# EasyEDA Pro project CheeseCake_1stAnn_SP.epro

# Schematic Choco_ANN
Create Date: 2024-06-27; Page Name: BNO085; Project Name: SlimeVR_CheeseCake_BNO085; Schematic Name: Choco_ANN; Update Date: 2024-06-27; Company: Designed by SoraKage; Page Size: A4; Version: V2.3
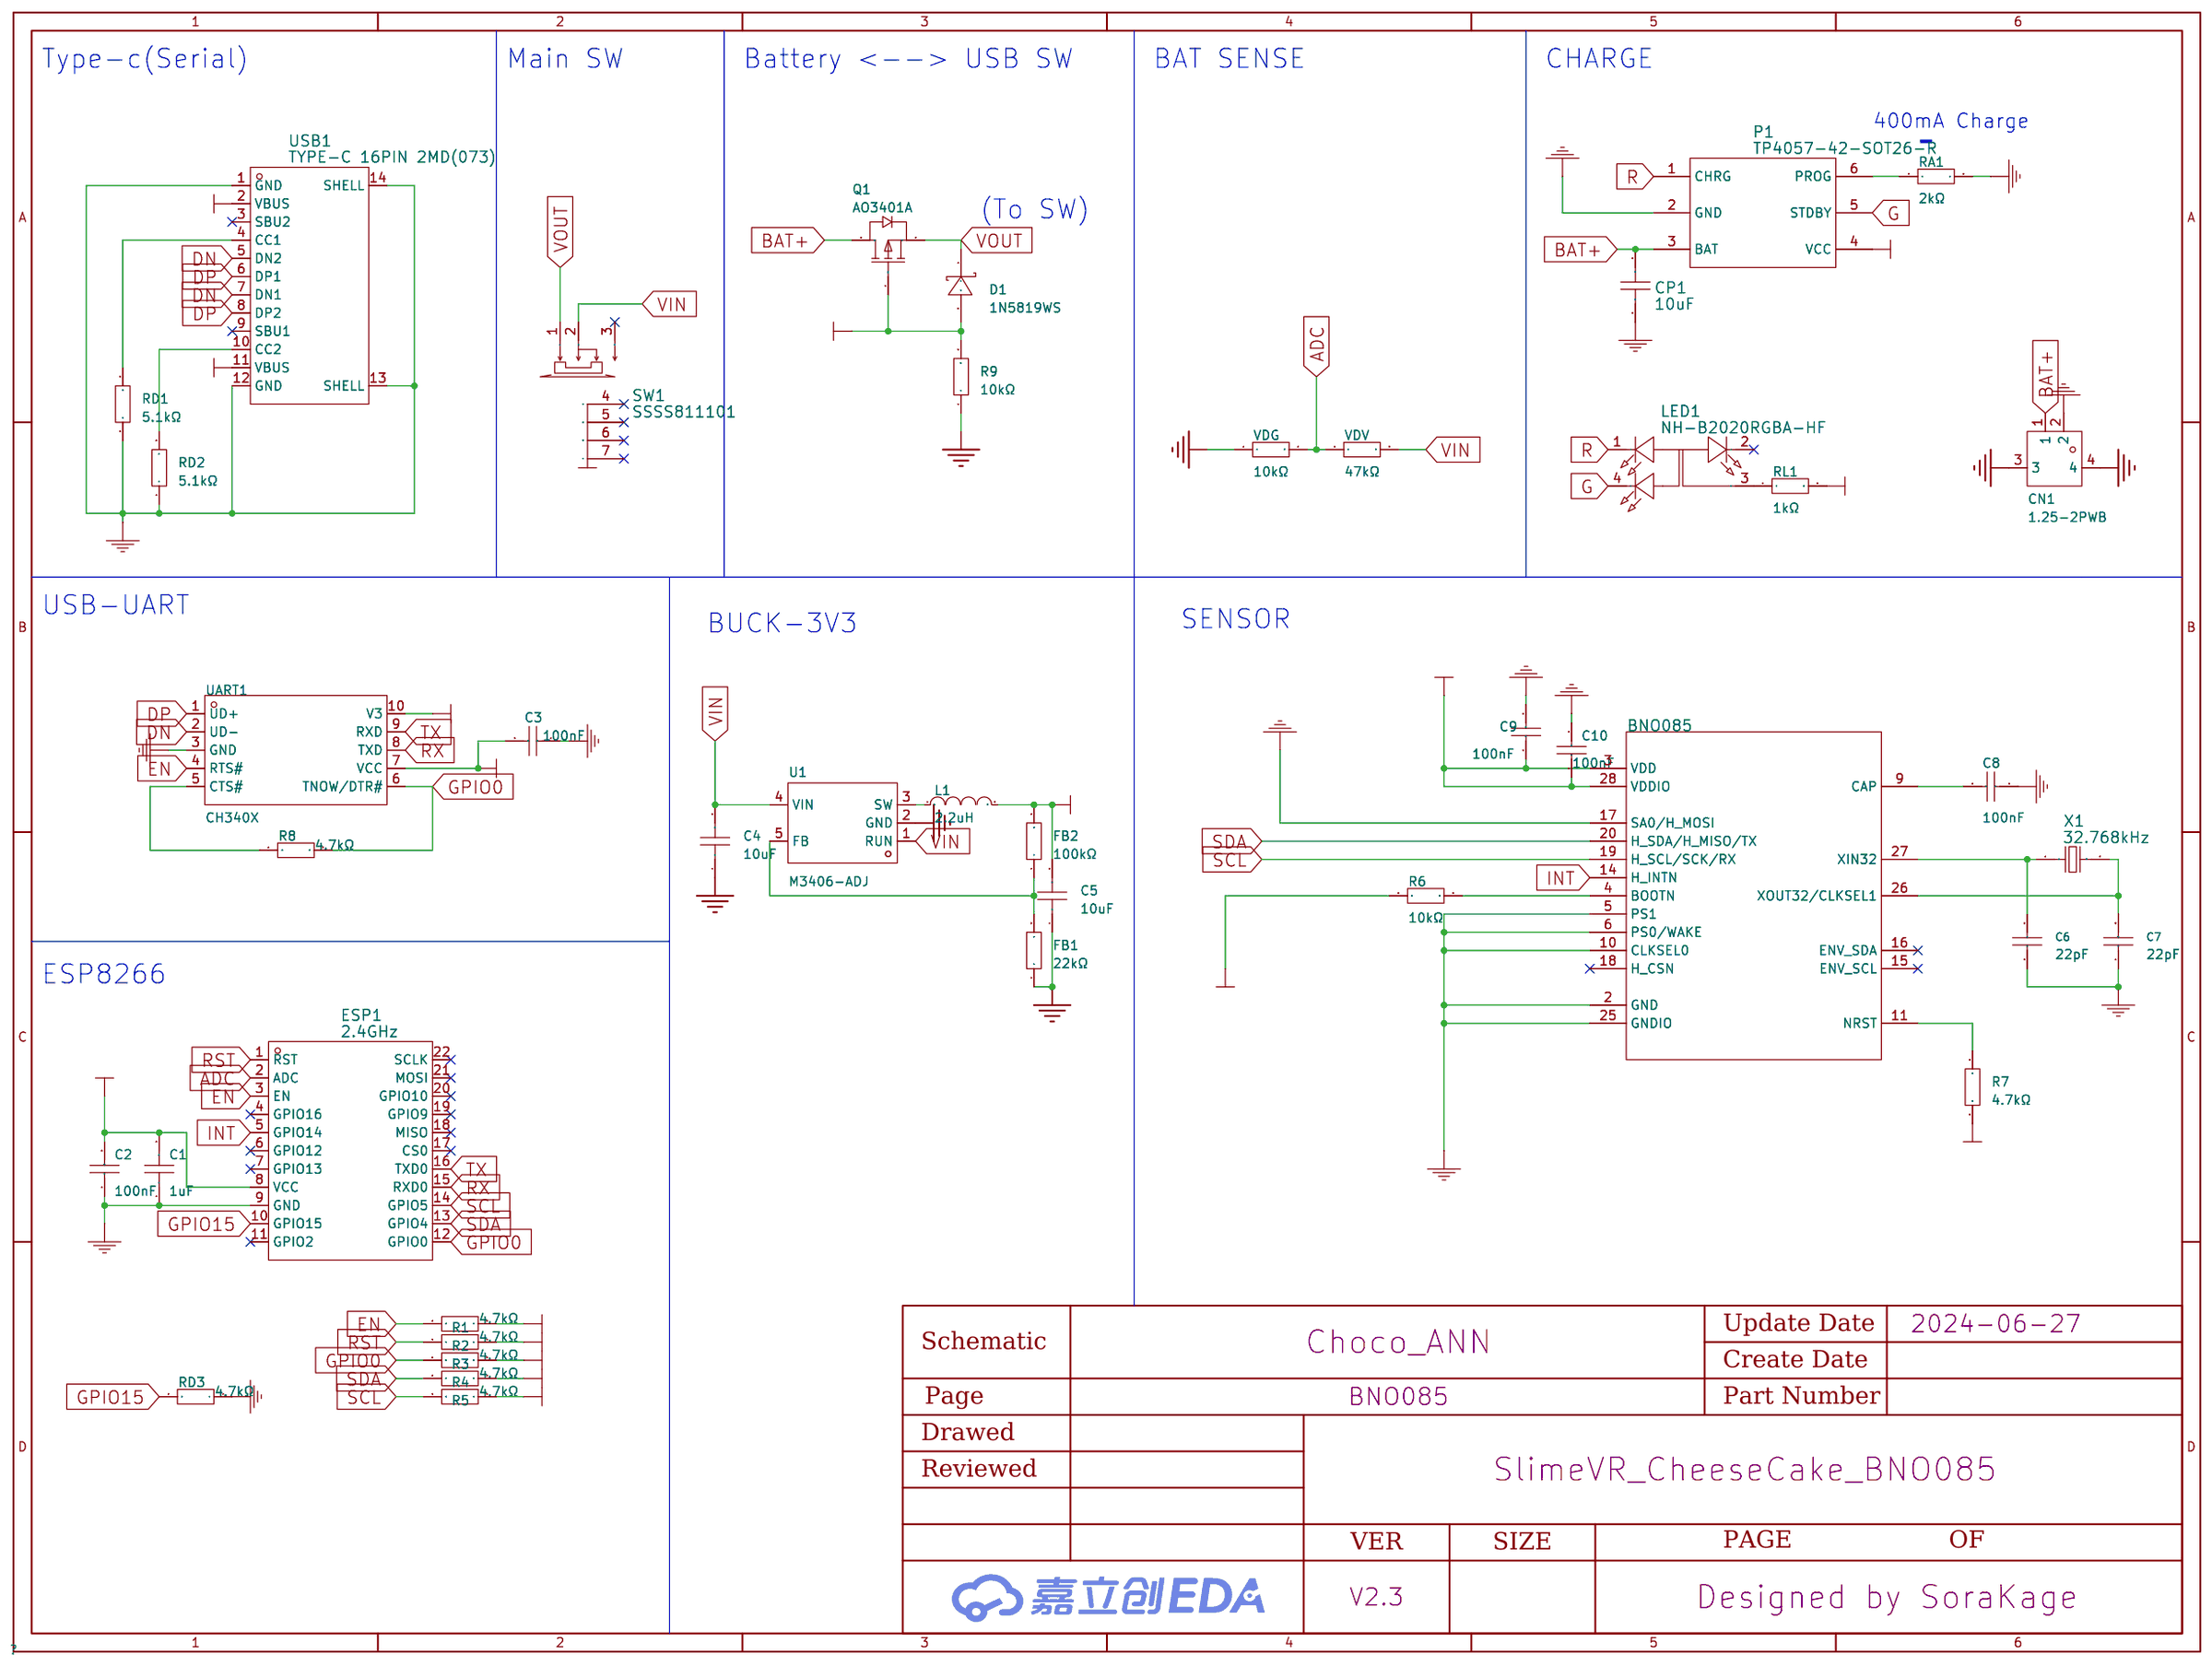
[diagram p0: schematic sheet]

## Parts
BNO085  BNO080  [BNO080]
C1  1uF  [C0402]
C2  100nF  [C0402]
C3  100nF  [C0402]
C4  10uF  [C0603]
C5  10uF  [C0603]
C6  22pF  [C0402]
C7  22pF  [C0402]
C8  100nF  [C0402]
C9  100nF  [C0402]
C10  100nF  [C0402]
CN1  1.25-2PWB  [CONN-SMD_2P-P1.25_DEALON_1.25-2PWB]
CP1  10uF  [C0603]
D1  1N5819WS  [SOD-323_L1.8-W1.3-LS2.5-RD]
ESP1  2.4GHz  [WIFIM-SMD_ESP-12F-ESP8266MOD]
FB1  22kΩ  [R0402]
FB2  100kΩ  [R0402]
L1  2.2uH  [IND-SMD_L2.5-W2.0_YXMBL252010P]
LED1  NH-B2020RGBA-HF  [LED-ARRAY-SMD_4P-L2.1-W2.1-TL_NH-B2020RGBA]
P1  TP4057-42-SOT26-R  [SOT-23-6_L2.9-W1.6-P0.95-LS2.8-BL]
Q1  AO3401A  [SOT-23_L2.9-W1.3-P1.90-LS2.4-BR]
R1  4.7kΩ  [R0402]
R2  4.7kΩ  [R0402]
R3  4.7kΩ  [R0402]
R4  4.7kΩ  [R0402]
R5  4.7kΩ  [R0402]
R6  10kΩ  [R0402]
R7  4.7kΩ  [R0402]
R8  4.7kΩ  [R0402]
R9  10kΩ  [R0402]
RA1  2kΩ  [R0402]
RD1  5.1kΩ  [R0402]
RD2  5.1kΩ  [R0402]
RD3  4.7kΩ  [R0402]
RL1  1kΩ  [R0402]
SW1  SSSS811101  [SW-SMD_SSSS811101]
U1  M3406-ADJ  [SOT-23-5_L3.0-W1.7-P0.95-LS2.8-BR]
UART1  CH340X  [MSOP-10_L3.0-W3.0-P0.50-LS5.0-BL]
USB1  TYPE-C 16PIN 2MD(073)  [USB-C-SMD_TYPE-C-6PIN-2MD-073]
VDG  10kΩ  [R0402]
VDV  47kΩ  [R0402]
X1  32.768kHz  [FC-135R_L3.2-W1.5]

## Library data of the parts
BNO085 = Hillcrest: Supplier: LCSC; Supplier Part: C5189642
C1 = CL05A105KA5NQNC: 容值:1uF;精度:±10%;额定电压:25V;材质(温度系数):X5R;; LCSC Part Name: 1uF ±10% 25V; Supplier Part: C52923; Manufacturer: SAMSUNG(三星); Supplier Footprint: 0402; JLCPCB Part Class: 基础库; Datasheet: https://atta.szlcsc.com/upload/public/pdf/source/20160103/1457707735223.pdf; Supplier: LCSC; Tolerance: ±10%; Voltage Rated: 25V; Temperature Coefficient: X5R
C2 C3 C8-C10 = CL05B104KO5NNNC: 容值:100nF;精度:±10%;额定电压:16V;材质(温度系数):X7R;; LCSC Part Name: 100nF ±10% 16V; Supplier Part: C1525; Manufacturer: SAMSUNG(三星); Supplier Footprint: 0402; JLCPCB Part Class: Basic Part; Datasheet: https://atta.szlcsc.com/upload/public/pdf/source/20160103/1457707674891.pdf; Supplier: LCSC; Tolerance: ±10%; Voltage Rated: 16V; Temperature Coefficient: X7R
C4 C5 = CL10A106KP8NNNC: 容值:10uF;精度:±10%;额定电压:10V;材质(温度系数):X5R;; LCSC Part Name: 10uF ±10% 10V; Supplier Part: C19702; Manufacturer: SAMSUNG(三星); Supplier Footprint: 0603; JLCPCB Part Class: 基础库; Datasheet: https://atta.szlcsc.com/upload/public/pdf/source/20160103/1457707703378.pdf; Supplier: LCSC; Tolerance: ±10%; Voltage Rated: 10V; Temperature Coefficient: X5R
C6 C7 = 0402CG220J500NT: 容值:22pF;精度:±5%;额定电压:50V;材质(温度系数):C0G;; LCSC Part Name: 22pF ±5% 50V; Supplier Part: C1555; Manufacturer: FH(风华); Supplier Footprint: 0402; JLCPCB Part Class: 基础库; Datasheet: https://atta.szlcsc.com/upload/public/pdf/source/20200305/C486355_26A10D38EF8C2A5C37091D0039909270.pdf; Supplier: LCSC; Tolerance: ±5%; Voltage Rated: 50V; Temperature Coefficient: C0G
CN1 = 1.25-2PWB: 插针结构:1x2P;间距:1.25mm;安装方式:卧贴;参考系列:-;总PIN数:2P;排数:1;每排PIN数:2;行距:-;额定电流:-;工作温度范围:-40℃~+85℃;; LCSC Part Name: 1x2P 间距:1.25mm 卧贴; Supplier Part: C2905009; Manufacturer: DEALON(德艺隆); Supplier Footprint: SMD,P=1.25mm,卧贴; JLCPCB Part Class: 扩展库; Datasheet: https://atta.szlcsc.com/upload/public/pdf/source/20231123/1AE0876AE9C7DCFC0D68EAC4CBA881B0.pdf; Supplier: LCSC; Pins Structure: 1x2P; Pitch: 1.25mm; Mounting Style: 卧贴; Number of Pins: 2P; Number of Rows: 1; Number of PINs Per Row: 2; Operating Temperature Range: -40℃~+85℃
CP1 = 10uF: link: https://item.szlcsc.com/362304.html; 3DModel: C0603_L1.6-W0.8-H0.8; Supplier: LCSC; Manufacturer: SAMSUNG(三星); Manufacturer Part: CL10A106KP8NNNC; Supplier Part: C19702; JLCPCB Part Class: Basic Part
D1 = 1N5819WS_C191023: 直流反向耐压(Vr):40V;平均整流电流(Io):1A;正向压降(Vf):600mV@1A;; LCSC Part Name: 40V 1A 600mV@1A; Supplier Part: C191023; Manufacturer: Hottech(合科泰); Supplier Footprint: SOD-323; JLCPCB Part Class: 基础库; Datasheet: https://atta.szlcsc.com/upload/public/pdf/source/20220428/3CB86FD8D28D653594B4E35F9D5AEFD9.pdf; Supplier: LCSC; Reverse Voltage (Vr): 40V; Average Rectified Current (Io): 1A; Forward Voltage (Vf@If): 600mV@1A
ESP1 = ESP-12F(ESP8266MOD): 频率:2.4GHz;发射功率:16dBm;核心处理器:ESP8266;天线形式:PCB 板载天线;接收灵敏度:-90dBm;; LCSC Part Name: 完整的802.11b/g/n Wi-Fi的SoC模块; Supplier Part: C82891; Manufacturer: Ai-Thinker(安信可); Supplier Footprint: SMD,16x24mm; JLCPCB Part Class: Extended Part; Datasheet: https://atta.szlcsc.com/upload/public/pdf/source/20210219/C82891_ABD84A460F4F056A2757267CCCA4B508.pdf; Supplier: LCSC; Output Power: 16dBm; Core Processor: ESP8266; Support Interface: GPIO；UART；I2C；PWM；SPI；ADC; Antenna Type: PCB 板载天线; Wireless Standard: 802.11b/g/n; Operating Voltage: 3.3V; Receive  Current: 120mA; Send  Current: 170mA; Sensitivity: -90dBm; Operating Temperature: -40℃~+85℃
FB1 = 0402WGF2202TCE: 电阻类型:厚膜电阻;阻值:22kΩ;精度:±1%;功率:62.5mW;; LCSC Part Name: 22kΩ ±1% 62.5mW; Supplier Part: C25768; Manufacturer: UNI-ROYAL(厚声); Supplier Footprint: 0402; JLCPCB Part Class: 基础库; Datasheet: https://atta.szlcsc.com/upload/public/pdf/source/20200306/C422600_1E6D84923E4A46A82E41ADD87F860B5C.pdf; Supplier: LCSC; Type: 厚膜电阻; Tolerance: ±1%; Power(Watts): 62.5mW; Temperature Coefficient: ±100ppm/℃; Overload Voltage (Max): 50V; Operating Temperature Range: -55℃~+155℃
FB2 = 0402WGF1003TCE: 电阻类型:厚膜电阻;阻值:100kΩ;精度:±1%;功率:62.5mW;; LCSC Part Name: 100kΩ ±1% 62.5mW; Supplier Part: C25741; Manufacturer: UNI-ROYAL(厚声); Supplier Footprint: 0402; JLCPCB Part Class: 基础库; Datasheet: https://atta.szlcsc.com/upload/public/pdf/source/20200306/C422600_1E6D84923E4A46A82E41ADD87F860B5C.pdf; Supplier: LCSC; Type: 厚膜电阻; Tolerance: ±1%; Power(Watts): 62.5mW; Temperature Coefficient: ±100ppm/℃; Overload Voltage (Max): 50V; Operating Temperature Range: -55℃~+155℃
L1 = APH252010T2R2M: 类型:一体成型电感;电感值:2.2uH;精度:±20%;额定电流:2.1A;饱和电流(Isat):3A;; LCSC Part Name: 2.2uH ±20% 3A; Supplier Part: C5349606; Manufacturer: APV(爱普微); Supplier Footprint: L252010; JLCPCB Part Class: 扩展库; Datasheet: https://atta.szlcsc.com/upload/public/pdf/source/20230112/CD71A991BF44148C80048C09E1A9BC6B.pdf; Supplier: LCSC; Type: 一体成型电感; Tolerance: ±20%; Rated Current: 2.1A; Saturation Current (Isat): 3A; DC Resistance (DCR): 70mΩ
LED1 = NH-B2020RGBA-HF: link: https://atta.szlcsc.com/upload/public/pdf/source/20210810/F2CC95523506BC87574AF0308E7F77A3.pdf; Supplier: LCSC; Supplier Part: C2874116; Manufacturer: 国星光电; JLCPCB Part Class: Extended Part
P1 = TP4057-42-SOT26-R: LCSC Part Name: TP4057 1%; Supplier Part: C12044; Manufacturer: TOPPOWER(南京拓微); Supplier Footprint: SOT-23-6; JLCPCB Part Class: Basic Part; Datasheet: https://atta.szlcsc.com/upload/public/pdf/source/20140228/1457706997013.pdf; Supplier: LCSC
Q1 = AO3401A_C15127: 类型:P沟道;漏源电压(Vdss):30V;连续漏极电流(Id):4A;功率(Pd):1.4W;导通电阻(RDS(on)@Vgs,Id):44mΩ@10V,4.3A;; LCSC Part Name: P沟道 30V 4A; Supplier Part: C15127; Manufacturer: AOS; Supplier Footprint: SOT-23-3L; JLCPCB Part Class: 基础库; Datasheet: https://atta.szlcsc.com/upload/public/pdf/source/20160507/1462613609053.pdf; Supplier: LCSC; Type: P沟道; Drain Source Voltage (Vdss): 30V; Continuous Drain Current (Id): 4A; Power Dissipation (Pd): 1.4W; Drain Source On Resistance (RDS(on)@Vgs,Id): 44mΩ@10V,4.3A; Gate Threshold Voltage (Vgs(th)@Id): 1.3V@250uA
R1-R5 R7 R8 RD3 = 0402WGF4701TCE: 电阻类型:厚膜电阻;阻值:4.7kΩ;精度:±1%;功率:62.5mW;; LCSC Part Name: 4.7kΩ ±1% 62.5mW; Supplier Part: C25900; Manufacturer: UNI-ROYAL(厚声); Supplier Footprint: 0402; JLCPCB Part Class: 基础库; Datasheet: https://atta.szlcsc.com/upload/public/pdf/source/20200306/C422600_1E6D84923E4A46A82E41ADD87F860B5C.pdf; Supplier: LCSC; Type: 厚膜电阻; Tolerance: ±1%; Power(Watts): 62.5mW; Temperature Coefficient: ±100ppm/℃; Overload Voltage (Max): 50V; Operating Temperature Range: -55℃~+155℃
R6 R9 VDG = 0402WGF1002TCE: 电阻类型:厚膜电阻;阻值:10kΩ;精度:±1%;功率:62.5mW;; LCSC Part Name: 10kΩ ±1% 62.5mW; Supplier Part: C25744; Manufacturer: UNI-ROYAL(厚声); Supplier Footprint: 0402; JLCPCB Part Class: 基础库; Datasheet: https://atta.szlcsc.com/upload/public/pdf/source/20200306/C422600_1E6D84923E4A46A82E41ADD87F860B5C.pdf; Supplier: LCSC; Type: 厚膜电阻; Tolerance: ±1%; Power(Watts): 62.5mW; Temperature Coefficient: ±100ppm/℃; Overload Voltage (Max): 50V; Operating Temperature Range: -55℃~+155℃
RA1 = 0402WGF2001TCE: 电阻类型:厚膜电阻;阻值:2kΩ;精度:±1%;功率:62.5mW;; LCSC Part Name: 2kΩ ±1% 62.5mW; Supplier Part: C4109; Manufacturer: UNI-ROYAL(厚声); Supplier Footprint: 0402; JLCPCB Part Class: 基础库; Datasheet: https://atta.szlcsc.com/upload/public/pdf/source/20200306/C422600_1E6D84923E4A46A82E41ADD87F860B5C.pdf; Supplier: LCSC; Type: 厚膜电阻; Tolerance: ±1%; Power(Watts): 62.5mW; Temperature Coefficient: ±100ppm/℃; Overload Voltage (Max): 50V; Operating Temperature Range: -55℃~+155℃
RD1 RD2 = 0402WGF5101TCE: 电阻类型:厚膜电阻;阻值:5.1kΩ;精度:±1%;功率:62.5mW;; LCSC Part Name: 5.1kΩ ±1% 62.5mW; Supplier Part: C25905; Manufacturer: UNI-ROYAL(厚声); Supplier Footprint: 0402; JLCPCB Part Class: 基础库; Datasheet: https://atta.szlcsc.com/upload/public/pdf/source/20200306/C422600_1E6D84923E4A46A82E41ADD87F860B5C.pdf; Supplier: LCSC; Type: 厚膜电阻; Tolerance: ±1%; Power(Watts): 62.5mW; Temperature Coefficient: ±100ppm/℃; Overload Voltage (Max): 50V; Operating Temperature Range: -55℃~+155℃
RL1 = 0402WGF1001TCE: 电阻类型:厚膜电阻;阻值:1kΩ;精度:±1%;功率:62.5mW;; LCSC Part Name: 1kΩ ±1% 62.5mW; Supplier Part: C11702; Manufacturer: UNI-ROYAL(厚声); Supplier Footprint: 0402; JLCPCB Part Class: 基础库; Datasheet: https://atta.szlcsc.com/upload/public/pdf/source/20200306/C422600_1E6D84923E4A46A82E41ADD87F860B5C.pdf; Supplier: LCSC; Type: 厚膜电阻; Tolerance: ±1%; Power(Watts): 62.5mW; Temperature Coefficient: ±100ppm/℃; Overload Voltage (Max): 50V; Operating Temperature Range: -55℃~+155℃
SW1 = SSSS811101: link: https://item.szlcsc.com/110556.html; 3DModel: SW-TH_SSSS811101; Supplier: LCSC; Manufacturer: ALPSALPINE(阿尔卑斯阿尔派); Supplier Part: C109335; JLCPCB Part Class: Extended Part
U1 = M3406-ADJ: 功能类型:降压型;同步整流:-;输出通道数:-;拓扑结构:-;输入电压:-;输出电流(最大值):-;开关频率:-;; LCSC Part Name: 降压型; Supplier Part: C83224; Manufacturer: 西安航天民芯; Supplier Footprint: SOT-23-5; JLCPCB Part Class: 扩展库; Datasheet: https://atta.szlcsc.com/upload/public/pdf/source/20161110/1478742836232.pdf; Supplier: LCSC; Function: 降压型
UART1 = CH340X: Supplier Part: C3035748; Manufacturer: WCH(南京沁恒); Supplier Footprint: MSOP-10; JLCPCB Part Class: Extended Part; Supplier: LCSC
USB1 = TYPE-C 16PIN 2MD(073): link: https://atta.szlcsc.com/upload/public/pdf/source/20210409/C2765186_34D42616F62DF94D17C4D63D74D9FD03.pdf; Supplier: LCSC; Supplier Part: C2765186; Manufacturer: SHOU HAN(首韩); JLCPCB Part Class: Extended Part
VDV = 0402WGF4702TCE: 电阻类型:厚膜电阻;阻值:47kΩ;精度:±1%;功率:62.5mW;; LCSC Part Name: 47kΩ ±1% 62.5mW; Supplier Part: C25792; Manufacturer: UNI-ROYAL(厚声); Supplier Footprint: 0402; JLCPCB Part Class: Basic Part; Datasheet: https://atta.szlcsc.com/upload/public/pdf/source/20200306/C422600_1E6D84923E4A46A82E41ADD87F860B5C.pdf; Supplier: LCSC; Type: 厚膜电阻; Tolerance: ±1%; Power(Watts): 62.5mW; Temperature Coefficient: ±100ppm/℃; Overload Voltage (Max): 50V; Operating Temperature Range: -55℃~+155℃
X1 = Q13FC1350000400: 频率:32.768kHz;频率公差:±20ppm;负载电容:12.5pF;; LCSC Part Name: 32.768kHz ±20ppm 12.5pF; Supplier Part: C32346; Manufacturer: EPSON(爱普生); Supplier Footprint: SMD3215-2P; JLCPCB Part Class: Basic Part; Datasheet: https://atta.szlcsc.com/upload/public/pdf/source/20190108/C32346_746D6B07EAF90824457A96480007685F.pdf; Supplier: LCSC; Crystal Type: 贴片无源晶振; Frequency Tolerance: ±20ppm; Load Capacitance: 12.5pF; Equivalent Series Resistance (ESR): 70kΩ; Operating Temperature: -40℃~+85℃

## Nets
3V3: BNO085.3(VDD) BNO085.28(VDDIO) C1.2 C2.2 C3.2 C5.2 C9.2 C10.2 ESP1.8(VCC) FB2.2 L1.2 R1.1 R2.1 R3.1 R4.1 R5.1 R6.1 R7.2 UART1.7(VCC) UART1.10(V3)
+5V: D1.2(A) P1.4(VCC) Q1.1(G) R9.2 RL1.2 USB1.2(VBUS) USB1.11(VBUS)
GND: BNO085.2(GND) BNO085.5(PS1) BNO085.6(PS0/WAKE) BNO085.10(CLKSEL0) BNO085.17(SA0/H_MOSI) BNO085.25(GNDIO) C1.1 C2.1 C3.1 C4.1 C5.1 C6.1 C7.1 C8.2 C9.1 C10.1 CN1.2 CN1.3 CN1.4 CP1.1 ESP1.9(GND) FB1.1 P1.2(GND) R9.1 RA1.2 RD1.1 RD2.1 RD3.1 U1.2(GND) UART1.3(GND) USB1.1(GND) USB1.12(GND) USB1.13(SHELL) USB1.14(SHELL) VDG.1
VIN: C4.2 SW1.2 U1.1(RUN) U1.4(VIN) VDV.2
ADC: ESP1.2(ADC) VDG.2 VDV.1
BAT+: CN1.1 CP1.2 P1.3(BAT) Q1.3(D)
DN: UART1.2(UD-) USB1.5(DN2) USB1.7(DN1)
DP: UART1.1(UD+) USB1.6(DP1) USB1.8(DP2)
EN: ESP1.3(EN) R1.2 UART1.4(RTS#)
G: LED1.4(-) P1.5(STDBY)
GPIO0: ESP1.12(GPIO0) R3.2 R8.1 UART1.6(TNOW/DTR#)
GPIO15: ESP1.10(GPIO15) RD3.2
INT: BNO085.14(H_INTN) ESP1.5(GPIO14)
R: LED1.1(-) P1.1(CHRG)
RST: ESP1.1(RST) R2.2
RX: ESP1.15(RXD0) UART1.8(TXD)
SCL: BNO085.19(H_SCL/SCK/RX) ESP1.14(GPIO5) R5.2
SDA: BNO085.20(H_SDA/H_MISO/TX) ESP1.13(GPIO4) R4.2
TX: ESP1.16(TXD0) UART1.9(RXD)
VOUT: D1.1(K) Q1.2(S) SW1.1
$1N6016: RD1.2 USB1.4(CC1)
$1N6017: RD2.2 USB1.10(CC2)
$1N6024: P1.6(PROG) RA1.1
$1N11317: BNO085.27(XIN32) C6.2 X1.1
$1N11318: BNO085.26(XOUT32/CLKSEL1) C7.2 X1.2
$1N11320: BNO085.9(CAP) C8.1
$1N11326: BNO085.4(BOOTN) R6.2
$1N11328: BNO085.11(NRST) R7.1
$1N28912: R8.2 UART1.5(CTS#)
$1N31333: L1.1 U1.3(SW)
$1N31339: FB1.2 FB2.1 U1.5(FB)
$1N32922: LED1.3(+) RL1.1

Not connected (* = marked no-connect by the designer): BNO085 15(ENV_SCL)* 16(ENV_SDA)* 18(H_CSN)*; ESP1 4(GPIO16)* 6(GPIO12)* 7(GPIO13)* 11(GPIO2)* 17(CS0)* 18(MISO)* 19(GPIO9)* 20(GPIO10)* 21(MOSI)* 22(SCLK)*; LED1 2(-)*; SW1 3* 4* 5* 6* 7*; USB1 3(SBU2)* 9(SBU1)*

## Notes on the sheet
- Type-c(Serial)
- Main SW
- Battery <--> USB SW
- BAT SENSE
- CHARGE
- 400mA Charge
- -
- (To SW)
- USB-UART
- BUCK-3V3
- SENSOR
- ESP8266

# Board Choco_ANN
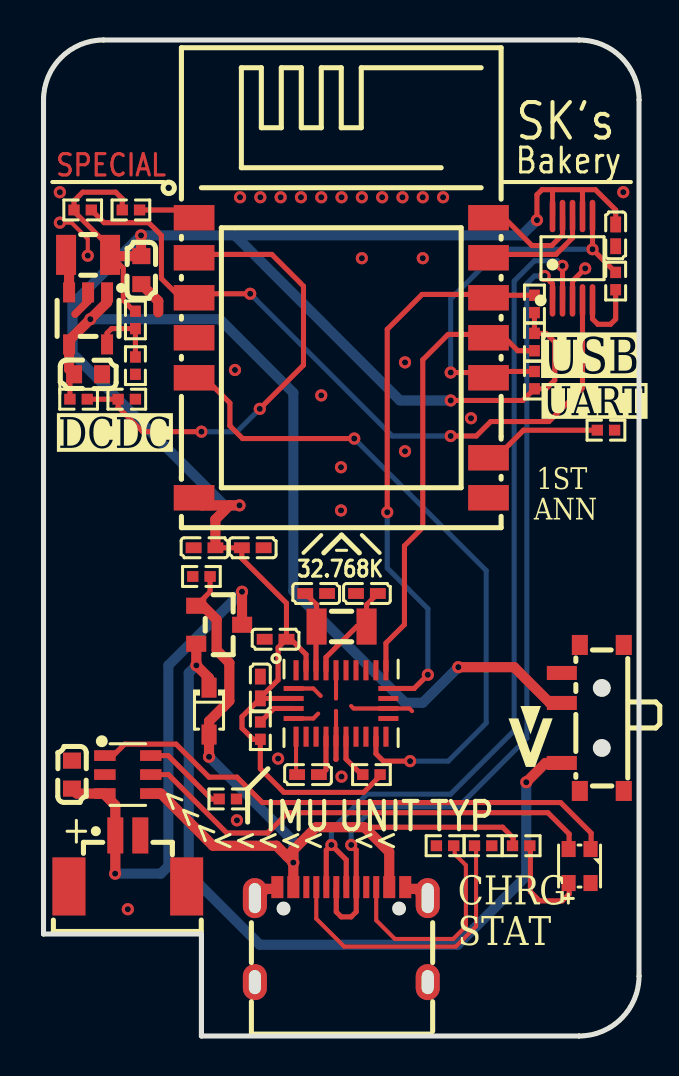
[diagram p1: board, top side]
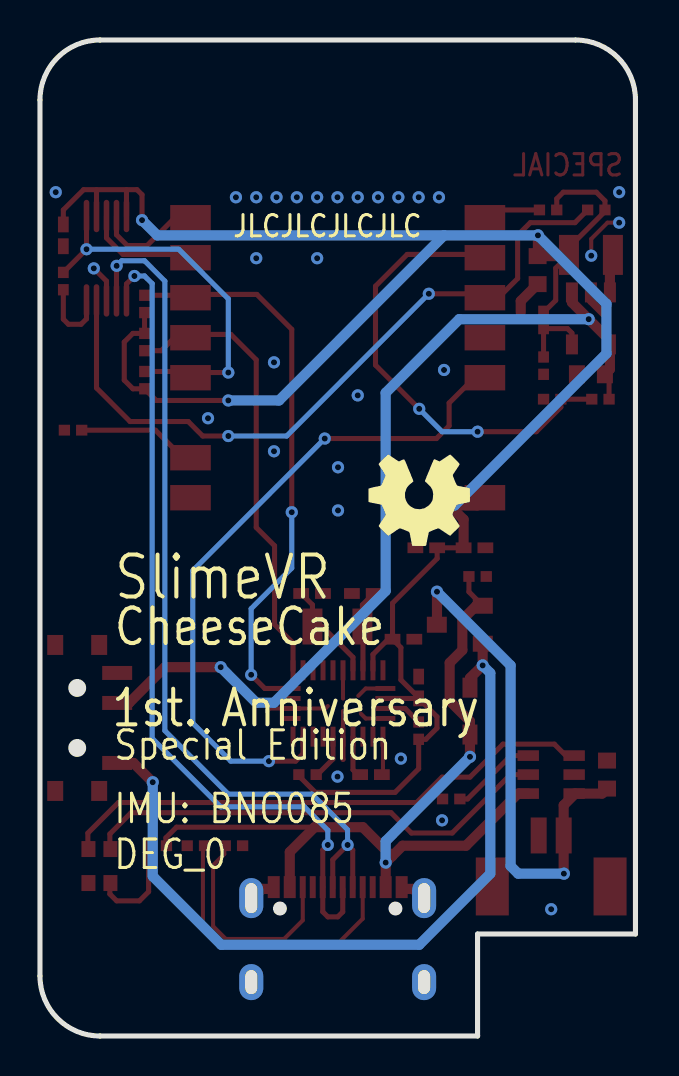
[diagram p2: board, bottom side, seen from below]

Outline 29.8 x 49.8 mm; copper layers: Top Layer, Bottom Layer. Coordinates in mm from the lower left corner of the outline.
Outline path: 0,46.8 arc(0.88,48.92) 3,49.8 26.8,49.8 arc(28.92,48.92) 29.8,46.8 29.8,3 arc(28.92,0.88) 26.8,0 7.9,0 7.9,5.1 0,5.1 0,46.8
Stack: Top Layer 0.035mm / Dielectric1 0.91mm FR4 er 4.5 / Bottom Layer 0.035mm

## Design rules (mm)
spacing Default (default): track to track 0.127, other pairs 0 to 0.127
track width Default (default): min 0.127, default 0.127, max 25.4
differential pair differentialPair (default): width min 0.127, default 0.254, max 2.54; gap min 0.152, default 0.152
via Default (default): diameter min 0.61, default 0.61, max 100.025; hole min 0.305, default 0.305, max 59.995
net GND uses gge20888(1)

## Placement (name value [footprint] x y rotation side)
BNO085  BNO080  [bno080]  14.89 16.63 90 top
C1  1uF  [C0402]  8.06 24.41 0 top
C2  100nF  [C0402]  10.47 24.41 180 top
C3  100nF  [C0402]  28.63 40.03 90 top
C4  10uF  [C0603]  2.23 33.09 180 top
C5  10uF  [C0603]  4.9 38.29 90 top
C6  22pF  [C0402]  13.64 22.12 180 top
C7  22pF  [C0402]  16.18 22.12 0 top
C8  100nF  [C0402]  13.24 13.07 180 top
C9  100nF  [C0402]  10.85 17.43 270 top
C10  100nF  [C0402]  11.61 19.84 0 top
CN1  1.25-2PWB  [conn-smd_2p-p1.25_dealon_1.25-2pwb]  4.22 8.75 0 top
CP1  10uF  [C0603]  1.42 13.07 270 top
D1  1N5819WS  [SOD-323_L1.8-W1.3-LS2.5-RD]  8.28 16.25 270 top
ESP1  2.4GHz  [wifim-smd_esp-12f-esp8266mod]  14.9 33.26 270 top
FB1  22kΩ  [R0402]  4.6 33.52 90 top
FB2  100kΩ  [R0402]  4.6 35.8 90 top
L1  2.2uH  [IND-SMD_L2.5-W2.0_YXMBL252010P]  2.23 39.06 180 top
LED1  NH-B2020RGBA-HF  [LED-ARRAY-SMD_4P-L2.1-W2.1-TL_NH-B2020RGBA]  26.82 8.5 270 top
P1  TP4057-42-SOT26-R  [SOT-23-6_L2.9-W1.6-P0.95-LS2.8-BL]  4.22 13.07 270 top
Q1  AO3401A  [SOT-23_L2.9-W1.3-P1.90-LS2.4-BR]  8.79 20.56 180 top
R1  4.7kΩ  [R0402]  1.96 41.3 0 top
R2  4.7kΩ  [R0402]  4.37 41.3 0 top
R3  4.7kΩ  [R0402]  24.57 32.79 90 top
R4  4.7kΩ  [R0402]  24.57 34.7 270 top
R5  4.7kΩ  [R0402]  24.57 36.6 90 top
R6  10kΩ  [R0402]  10.85 15.27 90 top
R7  4.7kΩ  [R0402]  16.41 13.07 0 top
R8  4.7kΩ  [R0402]  28.63 37.75 270 top
R9  10kΩ  [R0402]  7.9 22.98 0 top
RA1  2kΩ  [R0402]  9.22 11.85 0 top
RD1  5.1kΩ  [R0402]  22 9.51 180 top
RD2  5.1kΩ  [R0402]  20.09 9.51 0 top
RD3  4.7kΩ  [R0402]  28.15 30.29 180 top
RL1  1kΩ  [R0402]  23.9 9.51 180 top
SW1  SSSS811101  [SW-SMD_SSSS811101]  27.49 15.9 90 top
U1  M3406-ADJ  [SOT-23-5_L3.0-W1.7-P0.95-LS2.8-BR]  2.23 35.88 90 top
UART1  CH340X  [MSOP-10_L3.0-W3.0-P0.50-LS5.0-BL]  26.47 38.89 0 top
USB1  TYPE-C 16PIN 2MD(073)  [USB-C-SMD_TYPE-C-6PIN-2MD-073]  14.9 5.07 0 top
VDG  10kΩ  [R0402]  4.17 31.84 180 top
VDV  47kΩ  [R0402]  1.75 31.84 180 top
X1  32.768kHz  [FC-135R_L3.2-W1.5]  14.91 20.47 0 top

## Footprints (pads in the part's own frame, mm; a bottom-side part is the same pattern mirrored in y, then rotated)
bno080
  rect 1x0.25 smd: 1(1.66,2.25) 6(-1.66,2.251) 7(-1.66,1.75) 8(-1.66,1.25) 9(-1.66,0.75) 10(-1.66,0.25) 11(-1.66,-0.25) 12(-1.66,-0.75) 13(-1.66,-1.25) 14(-1.66,-1.75) 15(-1.66,-2.251) 20(1.66,-2.251) 21(1.66,-1.75) 22(1.66,-1.25) 23(1.66,-0.75) 24(1.66,-0.251) 25(1.66,0.25) 26(1.66,0.75) 27(1.66,1.25) 28(1.66,1.75)
  rect 0.25x1 smd: 2(0.75,2.369) 3(0.251,2.369) 4(-0.251,2.369) 5(-0.75,2.369) 16(-0.75,-2.37) 17(-0.25,-2.37) 18(0.25,-2.37) 19(0.75,-2.37)
C0402
  rect 0.79x0.54 smd: 1(-0.545,0) 2(0.545,0)
C0603
  rect 0.8x0.9 smd: 1(-0.7,0) 2(0.7,0)
conn-smd_2p-p1.25_dealon_1.25-2pwb
  rect 0.8x1.8 smd: 1(-0.625,1.275) 2(0.625,1.275)
  rect 1.651x2.9 smd: 3(-2.946,-1.275) 4(2.946,-1.275)
FC-135R_L3.2-W1.5
  rect 1x1.8 smd: 1(-1.25,0) 2(1.25,0)
IND-SMD_L2.5-W2.0_YXMBL252010P
  rect 1x2 smd: 1(1.1,0) 2(-1.1,0)
LED-ARRAY-SMD_4P-L2.1-W2.1-TL_NH-B2020RGBA
  rect 0.8x0.7 smd: 1(-0.85,0.55) 2(0.85,0.55) 3(0.85,-0.55) 4(-0.85,-0.55)
MSOP-10_L3.0-W3.0-P0.50-LS5.0-BL
  oval 0.28x1.62 smd: 1(-1,-2.11) 2(-0.5,-2.11) 3(0,-2.11) 4(0.5,-2.11) 5(1,-2.11) 6(1,2.11) 7(0.5,2.11) 8(0,2.11) 9(-0.5,2.11) 10(-1,2.11)
R0402
  rect 0.566x0.54 smd: 1(-0.433,0) 2(0.433,0)
SOD-323_L1.8-W1.3-LS2.5-RD
  rect 1x0.75 smd: 1(-1.173,0) 2(1.173,0)
SOT-23-5_L3.0-W1.7-P0.95-LS2.8-BR
  rect 1x0.6 smd: 1(1.3,-0.95) 2(1.3,0) 3(1.3,0.95) 4(-1.3,0.95) 5(-1.3,-0.95)
SOT-23-6_L2.9-W1.6-P0.95-LS2.8-BL
  rect 0.532x1.072 smd: 1(-0.95,-1.149) 2(0,-1.149) 3(0.95,-1.149) 4(0.95,1.149) 5(0,1.149) 6(-0.95,1.149)
SOT-23_L2.9-W1.3-P1.90-LS2.4-BR
  rect 1x0.8 smd: 1(1.15,-0.95) 2(1.15,0.95) 3(-1.15,0)
SW-SMD_SSSS811101
  rect 0.7x1.5 smd: 1(-2.25,1.55) 2(0.75,1.55) 3(2.25,1.55)
  rect 1x0.8 smd: 4(-3.65,0.65) 5(3.65,0.65) 6(3.65,-1.55) 7(-3.65,-1.55)
USB-C-SMD_TYPE-C-6PIN-2MD-073
  rect 0.6x1.1 smd: 1(-3.2,2.375) 2(-2.4,2.375) 11(2.4,2.375) 12(3.2,2.375)
  rect 0.3x1.1 smd: 3(-1.75,2.375) 4(-1.25,2.375) 5(-0.75,2.375) 6(-0.25,2.375) 7(0.25,2.375) 8(0.75,2.375) 9(1.25,2.375) 10(1.75,2.375)
  oval 1.2x2 hole 0.6x1.5: 13(-4.325,1.825) 14(4.325,1.825)
  oval 1.2x1.8 hole 0.6x1.2: 15(-4.325,-2.375) 16(4.325,-2.375)
wifim-smd_esp-12f-esp8266mod
  rect 1.27x2.032 smd: 1(-7.651,-7.366) 2(-5.651,-7.366) 3(-3.651,-7.366) 4(-1.651,-7.366) 5(0.349,-7.366) 8(6.349,-7.366) 9(6.349,7.366) 10(4.349,7.366) 12(0.349,7.366) 13(-1.651,7.366) 14(-3.651,7.366) 15(-5.651,7.366) 16(-7.651,7.366)

## Nets
As in the schematic, except:
GND: BNO085.2 BNO085.5 BNO085.6 BNO085.10 BNO085.17 BNO085.25 C1.1 C2.1 C3.1 C4.1 C5.1 C6.1 C7.1 C8.2 C9.1 C10.1 CN1.2 CN1.3 CN1.4 CP1.1 ESP1.9 FB1.1 P1.2 R9.1 RA1.2 RD1.1 RD2.1 RD3.1 U1.2 UART1.3 USB1.1 USB1.12 USB1.13 USB1.14 USB1.15 USB1.16 VDG.1

Pads without a net: BNO085 1 7 8 12 13 15 16 18 21 22 23 24; ESP1 4; LED1 2; SW1 3 4 5 6 7; USB1 3 9

## Via types
v1: diameter 0.61, hole 0.305, Top Layer to Bottom Layer, 55 vias

## Routing (per net, layer and track width the routed paths; a pad name or vN(x,y) marks a point on that pad's centre or on a via; arc(x,y) is an arc through that point)
3V3: length 114.8
  Top Layer w0.254: UART1.7 26.97,42.32 ; 3.39,38.99 3.99,38.39 3.99,36.78 4.63,36.15 ; v1(24.69,40.79) 24.69,42.06 24.95,42.32 27.61,42.32 28.63,41.3 C3.2 ; 16.74,13.11 16.74,12.91 16.02,12.18 12.03,12.18 10.85,13.36 R6.1 10.49,14.83 9.93,15.39 9.93,15.96 C9.2 10.85,16.92 ; R5.1 R4.1 25.15,35.13 25.58,34.7 25.58,32.79 25.15,32.36 R3.1 23.98,31.78 v1(20.38,31.78) ; 10.85,16.92 11.74,17.81 11.74,19.42 C10.2 ; 10.85,16.92 10.89,16.88 BNO085.3 ; L1.2 3.33,39.42 1.53,41.23 R1.1 1.53,41.76 1.96,42.19 3.61,42.19 3.94,41.86 R2.1 ; BNO085.28 13.14,19.08 12.37,19.84 C10.2 ; C1.2 C2.2 9.92,23.87 12.16,21.64 C10.2 ; UART1.10 25.47,42.32
  Top Layer w0.508: 9.31,26.53 8.6,25.83 8.6,24.67 ; 9.31,26.53 v1(9.81,26.53) ; 9.31,26.53 7.92,26.53 ESP1.8 ; L1.2 3.39,38.99 C5.2 4.88,39.01 v1(4.88,40.03)
  Bottom Layer w0.508: v1(24.69,40.79) 23.93,40.03 9.58,40.03 ; 9.58,40.03 v1(4.88,40.03) 1.45,36.6 1.45,34.12 9.04,26.53 v1(9.81,26.53) ; 9.58,40.03 17.84,31.78 v1(20.38,31.78)
+5V: length 44.2
  Top Layer w0.254: 23.5,9.55 23.5,9.91 22.97,10.44 16.06,10.44 ; Q1.1 8.33,22.21 R9.2
  Top Layer w0.508: Q1.1 7.97,21.51 8.66,20.82 8.66,19.29 9.3,18.66 9.3,16.75 8.28,15.74 D1.2 v1(8.28,13.96) ; v1(12.5,8.67) 12.19,8.98 ; v1(12.5,8.67) 12.5,9.3 ; v1(12.5,8.67) 12.5,7.36 ; 12.19,8.98 12.5,9.3 ; 12.19,8.98 11.66,9.51 8.48,9.51 5.88,12.12 P1.4 ; 12.5,9.3 13.64,10.44 16.06,10.44 17.3,9.2 17.3,7.36
  Bottom Layer w0.508: v1(12.5,8.67) 12.5,9.74 v1(8.28,13.96)
GND: length 22
  Top Layer w0.203: BNO085.6 12.64,13.12 C8.2 ; 13.74,16.12 13.5,15.88 BNO085.5 ; BNO085.25 14.64,16.88 14.63,16.88 ; v1(0.82,40.67) 1.4,40.67 2.21,39.85 v1(2.21,39.02) ; BNO085.10 14.64,16.24 14.63,16.25 ; 15.39,16.5 15.52,16.38 BNO085.17 18.31,16.38 18.44,16.25 ; 13.87,17.01 13.5,17.38 BNO085.2
  Top Layer w0.254: UART1.3 26.47,37.75 v1(27.11,38.38) ; 14.63,13.83 14.64,13.84 BNO085.10
  Top Layer w0.381: 1.58,36.09 2.23,36.75 U1.2
  Top Layer w0.508: 19.22,6.81 18.67,7.36 18.1,7.36 ; 10.57,6.81 11.12,7.36 11.7,7.36 ; C5.1 5.74,36.75 5.74,36.18
  vias: v1(0.82,42.19) v1(4.22,6.34) v1(9.58,33.3) v1(9.68,10.78) v1(9.83,41.94) v1(10.85,41.94) v1(11.74,13.87) v1(11.87,41.94) v1(12.88,41.94) v1(13.9,41.94) v1(13.9,32.03) v1(14.91,41.94) v1(14.89,28.44) v1(14.89,26.28) v1(14.91,12.97) v1(15.93,41.94) v1(15.93,38.89) v1(16.95,41.94) v1(17.96,41.94) v1(18.09,33.68) v1(18.09,29.24) v1(18.98,41.94) v1(18.98,38.89) v1(19.99,41.94) v1(21.39,30.89) v1(29.01,42.19)
VIN: length 45.1
  Top Layer w0.254: C4.2 1.32,32.88 VDV.2
  Top Layer w0.508: C4.2 1.28,33.34 U1.4 1.28,34.78 v1(2.34,35.84) 3.18,36.68 U1.1 ; v1(20.76,18.44) 23.55,18.44 25.34,16.65 SW1.2
  Bottom Layer w0.508: v1(2.34,35.84) 8.82,35.84 12.5,32.16 12.5,22.25 18.09,16.66 18.98,16.66 v1(20.76,18.44)
ADC: length 23.4
  Top Layer w0.254: VDV.1 VDG.2 3.73,31.44 4.96,30.22 v1(7.9,30.22) ; v1(10.82,31.36) 13.01,33.55 13.01,37.49 11.42,39.08 7.35,39.08
  Bottom Layer w0.254: v1(7.9,30.22) 9.68,30.22 v1(10.82,31.36)
BAT+: length 25.7
  Top Layer w0.508: 3.01,12.12 P1.3 ; 3.01,12.12 1.67,12.12 CP1.2 ; 3.01,12.12 3.59,11.54 CN1.1 3.59,8.13 v1(3.58,8.12) ; v1(9.93,22.21) 9.93,20.57 Q1.3
  Bottom Layer w0.508: v1(9.93,22.21) 6.25,18.53 6.25,8.5 5.87,8.12 v1(3.58,8.12)
DN: length 43.9
  Top Layer w0.254: v1(25.96,38.51) 25.97,38.5 UART1.2 ; 15.15,7.36 15.15,8.81 v1(14.41,9.55) 14.15,9.29 14.15,7.36
  Bottom Layer w0.254: v1(25.96,38.51) 25.71,38.76 24.57,38.76 23.55,37.75 23.55,15.27 20.38,12.09 16.18,12.09 14.41,10.31 v1(14.41,9.55)
DP: length 42.4
  Top Layer w0.254: UART1.1 25.47,37.6 v1(25.07,38) ; v1(15.4,9.55) 15.65,9.3 15.65,6.21 15.39,5.96 14.9,5.96 14.65,6.21 14.65,7.36
  Bottom Layer w0.254: v1(25.07,38) 24.57,38 24.19,37.62 24.19,14.89 20.76,11.46 16.56,11.46 15.4,10.29 v1(15.4,9.55)
EN: length 35.9
  Top Layer w0.254: R1.2 3.03,40.67 5.26,40.67 5.9,40.03 5.9,37.87 6.69,37.08 7.35,37.08 7.38,37.11 v1(10.34,37.11) ; v1(20.38,30) 21.66,30 22.38,30.72 25.29,30.72 26.97,32.4 UART1.4
  Bottom Layer w0.254: v1(20.38,30) 17.45,30 v1(10.34,37.11)
G: length 23.7
  Top Layer w0.254: P1.5 6.25,13.07 9.17,10.15 11.21,10.15 12.23,11.17 25.24,11.17 26.3,10.1 26.3,9.39
GPIO0: length 19.4
  Top Layer w0.254: R3.2 22.6,33.23 22.45,33.08 22.36,33.17 v1(20.38,33.17) ; R8.1 v1(27.47,39.34) UART1.6
  Bottom Layer w0.254: v1(20.38,33.17) 20.38,36.86 22.86,39.34 v1(27.47,39.34)
GPIO15: length 5.9
  Top Layer w0.254: 22.45,29.08 22.48,29.11 22.84,29.11 24.02,30.29 27.84,30.29
INT: length 34.5
  Top Layer w0.254: 7.35,33.08 7.9,33.08 9.33,31.65 9.33,30.51 9.96,29.87 v1(15.55,29.87) ; BNO085.14 16.64,14.11 17.01,13.74 v1(18.34,13.74)
  Bottom Layer w0.254: v1(15.55,29.87) 22.15,23.27 22.15,15.65 20.25,13.74 v1(18.34,13.74)
R: length 26.8
  Top Layer w0.254: 3.49,14.02 4.06,14.59 6.63,14.59 8.28,12.94 9.68,12.94 10.95,11.67 25.87,11.67 27.4,10.15 27.4,9.39
RST: length 2.6
  Top Layer w0.254: 7.35,41.08 7.12,41.3 R2.2
RX: length 5.5
  Top Layer w0.254: 22.45,39.08 25.64,39.08 26.47,39.91 UART1.8
SCL: length 28.5
  Top Layer w0.254: BNO085.19 18.55,17.38 v1(19.23,18.06) ; v1(17.2,26.19) 17.2,35.33 18.95,37.08 22.45,37.08 22.49,37.04 R5.2
  Bottom Layer w0.254: v1(17.2,26.19) 17.2,23.4 19.23,21.36 v1(19.23,18.06)
SDA: length 22.7
  Top Layer w0.254: R4.2 23.73,34.27 22.92,35.08 20.25,35.08 18.98,33.81 18.98,25.43 18.06,24.51 18.06,20.57 17.14,19.65 BNO085.20
TX: length 5.3
  Top Layer w0.254: UART1.9 25.97,40.06 25.43,39.52 24.44,39.52 22.88,41.08 22.45,41.08
VOUT: length 39.3
  Top Layer w0.508: SW1.1 25.12,13.65 v1(24.16,12.69) ; Q1.2 7.65,19.61 v1(7.65,18.53) 8.28,17.9 8.28,17.8
  Bottom Layer w0.508: v1(24.16,12.69) 24.16,7.99 20.73,4.56 10.82,4.56 7.27,8.12 7.27,18.15 v1(7.65,18.53)
$1N6016: length 14.6
  Top Layer w0.203: 13.65,7.36 13.65,5.86 15.04,4.47 20.63,4.47 21.65,5.49 21.65,9.5 21.59,9.55
$1N6017: length 11
  Top Layer w0.203: 20.58,9.55 20.58,9.1 21.14,8.54 21.14,5.49 20.5,4.85 17.58,4.85 16.65,5.79 16.65,7.36
$1N6024: length 4.3
  Top Layer w0.254: RA1.1 8.4,11.85 6.23,14.02 P1.6
$1N11317: length 4.1
  Top Layer w0.254: C6.2 13.66,21.56 X1.1 13.64,20.45 BNO085.27
$1N11318: length 5.2
  Top Layer w0.254: C7.2 16.16,21.56 X1.2 15.68,20.47 14.14,18.93 BNO085.26
$1N11320: length 1.9
  Top Layer w0.254: 13.94,13.11 14.14,13.31 BNO085.9
$1N11326: length 1.9
  Top Layer w0.254: R6.2 11.53,16.38 BNO085.4
$1N11328: length 2.2
  Top Layer w0.254: 15.88,13.11 15.14,13.85 BNO085.11
$1N28912: length 3.8
  Top Layer w0.254: R8.2 28.63,35.84 28.38,35.59 27.74,35.59 27.47,35.86 UART1.5
$1N31333: length 1.9
  Top Layer w0.508: U1.3 1.28,38.91 L1.1
$1N31339: length 3.5
  Top Layer w0.254: FB1.2 FB2.1 3.4,35.37 3.18,35.15 U1.5
$1N32922: length 5.2
  Top Layer w0.254: 26.3,7.69 26.3,7.1 25.96,6.76 24.82,6.76 24.36,7.21 24.36,9.55

## Copper pours and planes (outline as drawn; the poured copper is in the pictures)
GND on Top Layer: -2.64,54.34 31.02,54.34 31.02,-12.84 -2.64,-12.84
GND on Bottom Layer: -8.61,52.57 30.63,52.57 30.63,-1.79 -8.61,-1.79

## Text on the board
Bottom Silkscreen Layer: JLCJLCJLCJLC | Special Edition | IMU: BNO085 / DEG_0 | CheeseCake | 1st. Anniversary | SlimeVR
Document Layer: Y | TP4057:2K | DEG_0
Top Layer: SPECIAL
Top Solder Mask Layer: 400mA | 5V | SPECIAL | - | BNO | 085 | ▲
Top Silkscreen Layer: 32.768K | >>> | >>  >>>>> | Bakery | + | IMU | UNIT | TYP | SK's | CHRG | STAT | UART | DCDC | USB | ANN | 1ST
